# Altium schematic sheet fpga10-serdes-power.SchDoc
size Tabloid; SheetNumber: 71; SheetTotal: 71
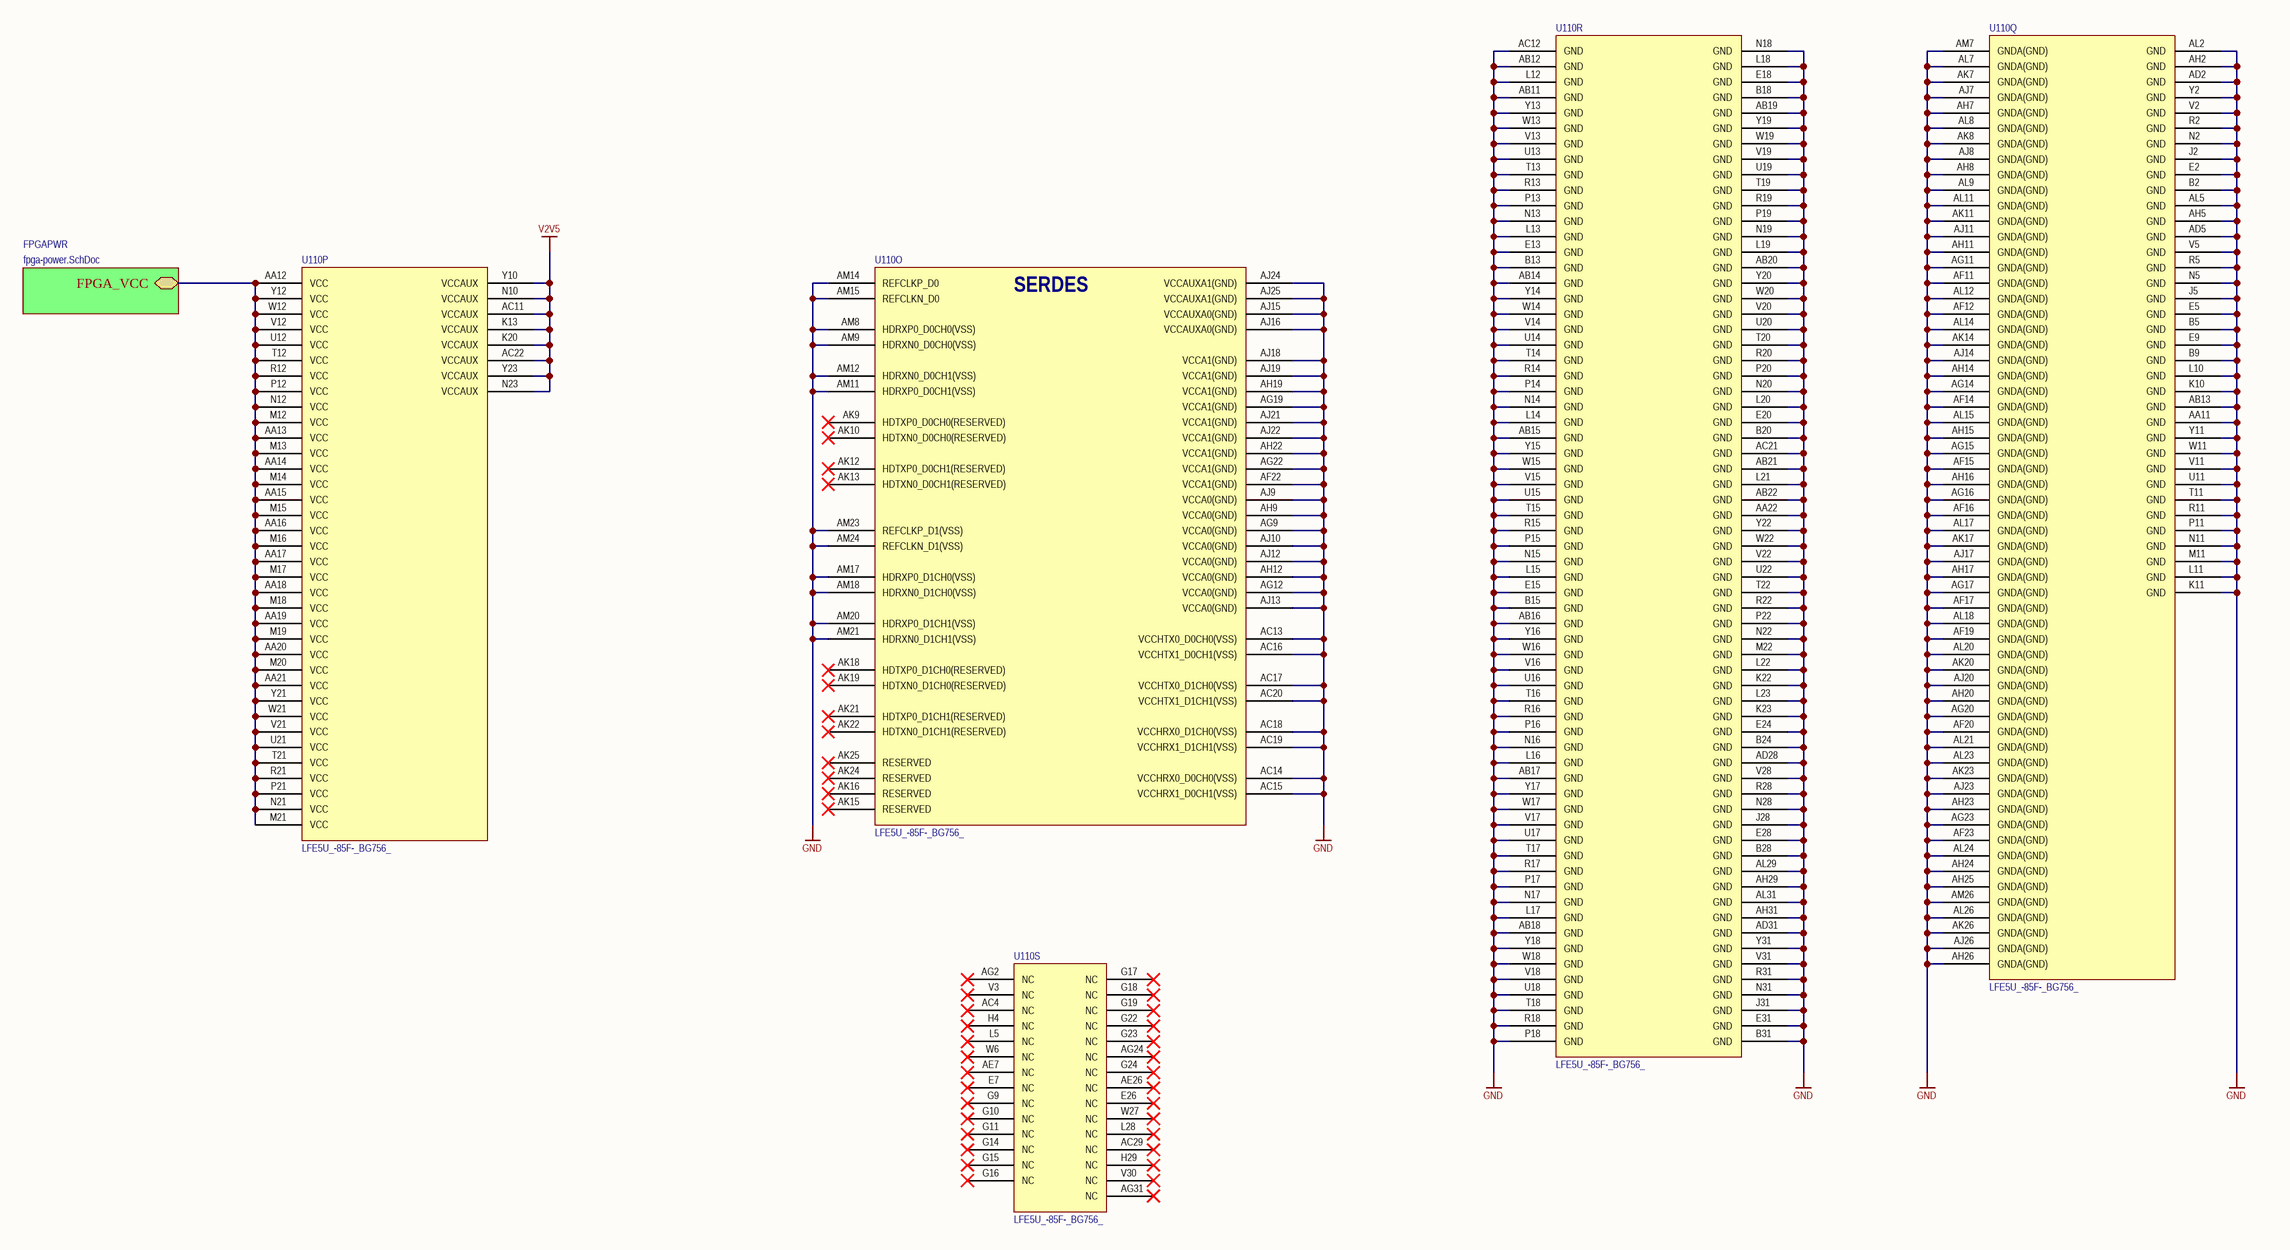
[diagram p0: fpga10-serdes-power.SchDoc]

## Parts
U110  LFE5U_-85F-_BG756_  [caBGA756]  (parts O,P,Q,R,S of 19)

## Sub-sheets
FPGAPWR = fpga-power.SchDoc: FPGA_VCC

## Nets
GND: U110.AA11(GND) U110.AA22(GND) U110.AB11(GND) U110.AB12(GND) U110.AB13(GND) U110.AB14(GND) U110.AB15(GND) U110.AB16(GND) U110.AB17(GND) U110.AB18(GND) U110.AB19(GND) U110.AB20(GND) U110.AB21(GND) U110.AB22(GND) U110.AC12(GND) U110.AC13(VCCHTX0_D0CH0(VSS)) U110.AC14(VCCHRX0_D0CH0(VSS)) U110.AC15(VCCHRX1_D0CH1(VSS)) U110.AC16(VCCHTX1_D0CH1(VSS)) U110.AC17(VCCHTX0_D1CH0(VSS)) U110.AC18(VCCHRX0_D1CH0(VSS)) U110.AC19(VCCHRX1_D1CH1(VSS)) U110.AC20(VCCHTX1_D1CH1(VSS)) U110.AC21(GND) U110.AD2(GND) U110.AD5(GND) U110.AD28(GND) U110.AD31(GND) U110.AF11(GNDA(GND)) U110.AF12(GNDA(GND)) U110.AF14(GNDA(GND)) U110.AF15(GNDA(GND)) U110.AF16(GNDA(GND)) U110.AF17(GNDA(GND)) U110.AF19(GNDA(GND)) U110.AF20(GNDA(GND)) U110.AF22(VCCA1(GND)) U110.AF23(GNDA(GND)) U110.AG9(VCCA0(GND)) U110.AG11(GNDA(GND)) U110.AG12(VCCA0(GND)) U110.AG14(GNDA(GND)) U110.AG15(GNDA(GND)) U110.AG16(GNDA(GND)) U110.AG17(GNDA(GND)) U110.AG19(VCCA1(GND)) U110.AG20(GNDA(GND)) U110.AG22(VCCA1(GND)) U110.AG23(GNDA(GND)) U110.AH2(GND) U110.AH5(GND) U110.AH7(GNDA(GND)) U110.AH8(GNDA(GND)) U110.AH9(VCCA0(GND)) U110.AH11(GNDA(GND)) U110.AH12(VCCA0(GND)) U110.AH14(GNDA(GND)) U110.AH15(GNDA(GND)) U110.AH16(GNDA(GND)) U110.AH17(GNDA(GND)) U110.AH19(VCCA1(GND)) U110.AH20(GNDA(GND)) U110.AH22(VCCA1(GND)) U110.AH23(GNDA(GND)) U110.AH24(GNDA(GND)) U110.AH25(GNDA(GND)) U110.AH26(GNDA(GND)) U110.AH29(GND) U110.AH31(GND) U110.AJ7(GNDA(GND)) U110.AJ8(GNDA(GND)) U110.AJ9(VCCA0(GND)) U110.AJ10(VCCA0(GND)) U110.AJ11(GNDA(GND)) U110.AJ12(VCCA0(GND)) U110.AJ13(VCCA0(GND)) U110.AJ14(GNDA(GND)) U110.AJ15(VCCAUXA0(GND)) U110.AJ16(VCCAUXA0(GND)) U110.AJ17(GNDA(GND)) U110.AJ18(VCCA1(GND)) U110.AJ19(VCCA1(GND)) U110.AJ20(GNDA(GND)) U110.AJ21(VCCA1(GND)) U110.AJ22(VCCA1(GND)) U110.AJ23(GNDA(GND)) U110.AJ24(VCCAUXA1(GND)) U110.AJ25(VCCAUXA1(GND)) U110.AJ26(GNDA(GND)) U110.AK7(GNDA(GND)) U110.AK8(GNDA(GND)) U110.AK11(GNDA(GND)) U110.AK14(GNDA(GND)) U110.AK17(GNDA(GND)) U110.AK20(GNDA(GND)) U110.AK23(GNDA(GND)) U110.AK26(GNDA(GND)) U110.AL2(GND) U110.AL5(GND) U110.AL7(GNDA(GND)) U110.AL8(GNDA(GND)) U110.AL9(GNDA(GND)) U110.AL11(GNDA(GND)) U110.AL12(GNDA(GND)) U110.AL14(GNDA(GND)) U110.AL15(GNDA(GND)) U110.AL17(GNDA(GND)) U110.AL18(GNDA(GND)) U110.AL20(GNDA(GND)) U110.AL21(GNDA(GND)) U110.AL23(GNDA(GND)) U110.AL24(GNDA(GND)) U110.AL26(GNDA(GND)) U110.AL29(GND) U110.AL31(GND) U110.AM7(GNDA(GND)) U110.AM8(HDRXP0_D0CH0(VSS)) U110.AM9(HDRXN0_D0CH0(VSS)) U110.AM11(HDRXP0_D0CH1(VSS)) U110.AM12(HDRXN0_D0CH1(VSS)) U110.AM14(REFCLKP_D0) U110.AM15(REFCLKN_D0) U110.AM17(HDRXP0_D1CH0(VSS)) U110.AM18(HDRXN0_D1CH0(VSS)) U110.AM20(HDRXP0_D1CH1(VSS)) U110.AM21(HDRXN0_D1CH1(VSS)) U110.AM23(REFCLKP_D1(VSS)) U110.AM24(REFCLKN_D1(VSS)) U110.AM26(GNDA(GND)) U110.B2(GND) U110.B5(GND) U110.B9(GND) U110.B13(GND) U110.B15(GND) U110.B18(GND) U110.B20(GND) U110.B24(GND) U110.B28(GND) U110.B31(GND) U110.E2(GND) U110.E5(GND) U110.E9(GND) U110.E13(GND) U110.E15(GND) U110.E18(GND) U110.E20(GND) U110.E24(GND) U110.E28(GND) U110.E31(GND) U110.J2(GND) U110.J5(GND) U110.J28(GND) U110.J31(GND) U110.K10(GND) U110.K11(GND) U110.K22(GND) U110.K23(GND) U110.L10(GND) U110.L11(GND) U110.L12(GND) U110.L13(GND) U110.L14(GND) U110.L15(GND) U110.L16(GND) U110.L17(GND) U110.L18(GND) U110.L19(GND) U110.L20(GND) U110.L21(GND) U110.L22(GND) U110.L23(GND) U110.M11(GND) U110.M22(GND) U110.N2(GND) U110.N5(GND) U110.N11(GND) U110.N13(GND) U110.N14(GND) U110.N15(GND) U110.N16(GND) U110.N17(GND) U110.N18(GND) U110.N19(GND) U110.N20(GND) U110.N22(GND) U110.N28(GND) U110.N31(GND) U110.P11(GND) U110.P13(GND) U110.P14(GND) U110.P15(GND) U110.P16(GND) U110.P17(GND) U110.P18(GND) U110.P19(GND) U110.P20(GND) U110.P22(GND) U110.R2(GND) U110.R5(GND) U110.R11(GND) U110.R13(GND) U110.R14(GND) U110.R15(GND) U110.R16(GND) U110.R17(GND) U110.R18(GND) U110.R19(GND) U110.R20(GND) U110.R22(GND) U110.R28(GND) U110.R31(GND) U110.T11(GND) U110.T13(GND) U110.T14(GND) U110.T15(GND) U110.T16(GND) U110.T17(GND) U110.T18(GND) U110.T19(GND) U110.T20(GND) U110.T22(GND) U110.U11(GND) U110.U13(GND) U110.U14(GND) U110.U15(GND) U110.U16(GND) U110.U17(GND) U110.U18(GND) U110.U19(GND) U110.U20(GND) U110.U22(GND) U110.V2(GND) U110.V5(GND) U110.V11(GND) U110.V13(GND) U110.V14(GND) U110.V15(GND) U110.V16(GND) U110.V17(GND) U110.V18(GND) U110.V19(GND) U110.V20(GND) U110.V22(GND) U110.V28(GND) U110.V31(GND) U110.W11(GND) U110.W13(GND) U110.W14(GND) U110.W15(GND) U110.W16(GND) U110.W17(GND) U110.W18(GND) U110.W19(GND) U110.W20(GND) U110.W22(GND) U110.Y2(GND) U110.Y11(GND) U110.Y13(GND) U110.Y14(GND) U110.Y15(GND) U110.Y16(GND) U110.Y17(GND) U110.Y18(GND) U110.Y19(GND) U110.Y20(GND) U110.Y22(GND) U110.Y31(GND)
V2V5: U110.AC11(VCCAUX) U110.AC22(VCCAUX) U110.K13(VCCAUX) U110.K20(VCCAUX) U110.N10(VCCAUX) U110.N23(VCCAUX) U110.Y10(VCCAUX) U110.Y23(VCCAUX)
NetU110_AA12: U110.AA12(VCC) U110.AA13(VCC) U110.AA14(VCC) U110.AA15(VCC) U110.AA16(VCC) U110.AA17(VCC) U110.AA18(VCC) U110.AA19(VCC) U110.AA20(VCC) U110.AA21(VCC) U110.M12(VCC) U110.M13(VCC) U110.M14(VCC) U110.M15(VCC) U110.M16(VCC) U110.M17(VCC) U110.M18(VCC) U110.M19(VCC) U110.M20(VCC) U110.M21(VCC) U110.N12(VCC) U110.N21(VCC) U110.P12(VCC) U110.P21(VCC) U110.R12(VCC) U110.R21(VCC) U110.T12(VCC) U110.T21(VCC) U110.U12(VCC) U110.U21(VCC) U110.V12(VCC) U110.V21(VCC) U110.W12(VCC) U110.W21(VCC) U110.Y12(VCC) U110.Y21(VCC) ; sheet FPGAPWR/FPGA_VCC

Not connected (* = marked no-connect by the designer): U110 AC4(NC)* AC29(NC)* AE7(NC)* AE26(NC)* AG2(NC)* AG24(NC)* AG31(NC)* AK9(HDTXP0_D0CH0(RESERVED))* AK10(HDTXN0_D0CH0(RESERVED))* AK12(HDTXP0_D0CH1(RESERVED))* AK13(HDTXN0_D0CH1(RESERVED))* AK15(RESERVED)* AK16(RESERVED)* AK18(HDTXP0_D1CH0(RESERVED))* AK19(HDTXN0_D1CH0(RESERVED))* AK21(HDTXP0_D1CH1(RESERVED))* AK22(HDTXN0_D1CH1(RESERVED))* AK24(RESERVED)* AK25(RESERVED)* E7(NC)* E26(NC)* G9(NC)* G10(NC)* G11(NC)* G14(NC)* G15(NC)* G16(NC)* G17(NC)* G18(NC)* G19(NC)* G22(NC)* G23(NC)* G24(NC)* H4(NC)* H29(NC)* L5(NC)* L28(NC)* V3(NC)* V30(NC)* W6(NC)* W27(NC)*

## Notes on the sheet
- (in symbol LFE5U_-85F-_BG756_, part O) SERDES

## Library data of the parts
U110 = LFE5U_-85F-_BG756_: ECP5 FPGA, 85k LUT, 756-caBGA; Manufacturer: Lattice Semiconductor; Manufacturer P/N: LFE5U_-85F-_BG756_